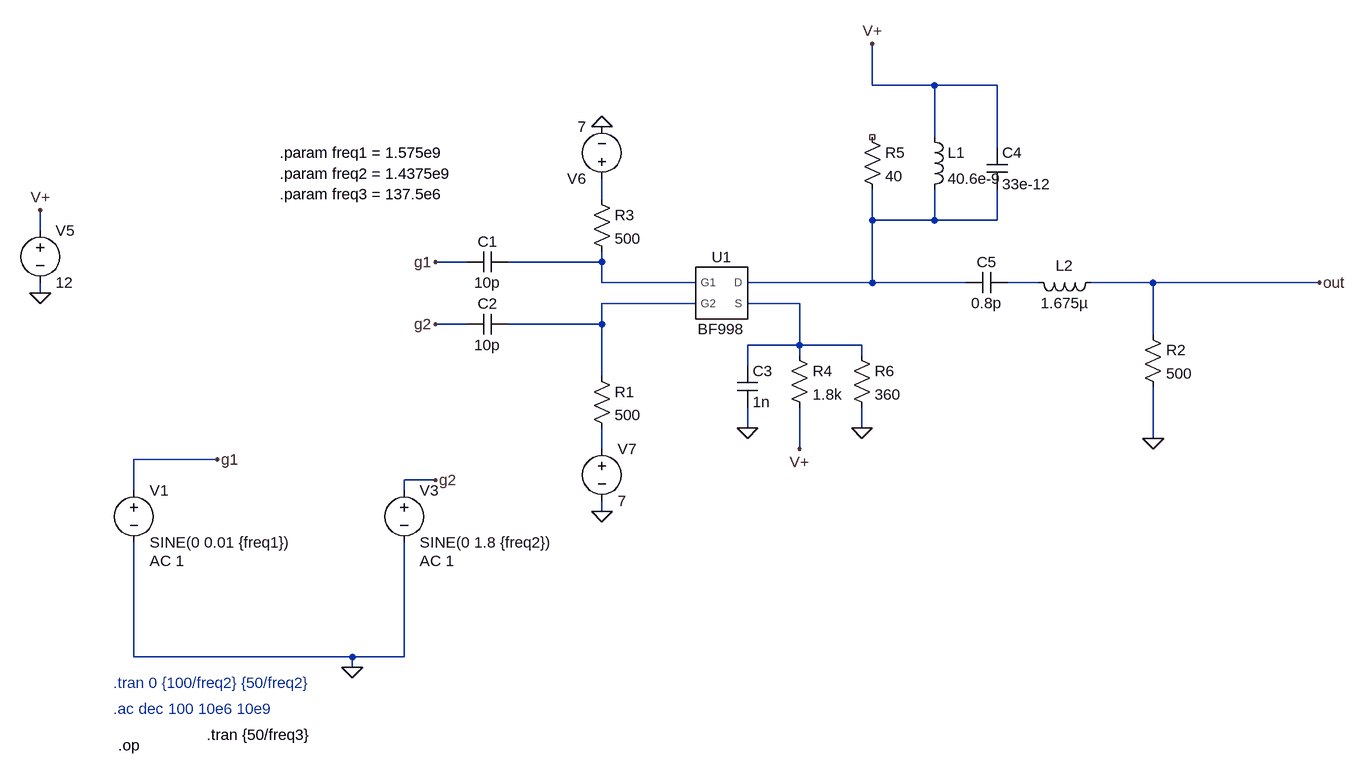
[diagram p0: schematic bf998.asc]
bf998.asc, the LTspice schematic file:
Version 4
SHEET 1 2012 1384
WIRE -64 352 -64 288
WIRE 32 352 -64 352
WIRE 128 352 32 352
WIRE 32 432 32 352
WIRE 128 448 128 352
WIRE -480 528 -480 496
WIRE -64 560 -64 512
WIRE 32 560 32 512
WIRE 32 560 -64 560
WIRE 128 560 128 512
WIRE 128 560 32 560
WIRE -1344 576 -1344 544
WIRE -688 624 -736 624
WIRE -480 624 -480 608
WIRE -480 624 -624 624
WIRE -480 656 -480 624
WIRE -336 656 -480 656
WIRE -64 656 -64 560
WIRE -64 656 -256 656
WIRE 80 656 -64 656
WIRE 192 656 144 656
WIRE 368 656 272 656
WIRE 624 656 368 656
WIRE -1344 672 -1344 656
WIRE -336 688 -480 688
WIRE -176 688 -256 688
WIRE -688 720 -736 720
WIRE -480 720 -480 688
WIRE -480 720 -624 720
WIRE 368 736 368 656
WIRE -176 752 -176 688
WIRE -176 752 -256 752
WIRE -80 752 -176 752
WIRE -176 768 -176 752
WIRE -80 768 -80 752
WIRE -256 784 -256 752
WIRE -480 800 -480 720
WIRE -256 880 -256 848
WIRE -80 880 -80 848
WIRE 368 896 368 816
WIRE -480 912 -480 880
WIRE -176 912 -176 848
WIRE -1072 928 -1200 928
WIRE -736 960 -784 960
WIRE -1200 976 -1200 928
WIRE -784 976 -784 960
WIRE -480 1008 -480 992
WIRE -1200 1232 -1200 1056
WIRE -864 1232 -1200 1232
WIRE -784 1232 -784 1056
WIRE -784 1232 -864 1232
WIRE -864 1248 -864 1232
FLAG -176 912 V+
FLAG -864 1248 0
FLAG -1344 672 0
FLAG -1072 928 g1
FLAG -736 960 g2
FLAG 624 656 out
FLAG -736 624 g1
FLAG -736 720 g2
FLAG -480 416 0
FLAG -480 1008 0
FLAG 368 896 0
FLAG -1344 544 V+
FLAG -64 288 V+
FLAG -256 880 0
FLAG -80 880 0
SYMBOL voltage -1200 960 R0
WINDOW 123 24 124 Left 2
WINDOW 39 0 0 Left 0
SYMATTR Value2 AC 1
SYMATTR InstName V1
SYMATTR Value SINE(0 0.01 {freq1})
SYMBOL voltage -784 960 R0
WINDOW 123 24 124 Left 2
WINDOW 39 0 0 Left 0
SYMATTR Value2 AC 1
SYMATTR InstName V3
SYMATTR Value SINE(0 1.8 {freq2})
SYMBOL voltage -1344 560 R0
WINDOW 123 0 0 Left 0
WINDOW 39 0 0 Left 0
SYMATTR InstName V5
SYMATTR Value 12
SYMBOL BF998 -304 672 R0
SYMATTR InstName U1
SYMBOL res 352 720 R0
SYMATTR InstName R2
SYMATTR Value 500
SYMBOL res -496 784 R0
SYMATTR InstName R1
SYMATTR Value 500
SYMBOL res -496 512 R0
SYMATTR InstName R3
SYMATTR Value 500
SYMBOL cap -624 608 R90
WINDOW 0 0 32 VBottom 2
WINDOW 3 32 32 VTop 2
SYMATTR InstName C1
SYMATTR Value 10p
SYMBOL cap -624 704 R90
WINDOW 0 0 32 VBottom 2
WINDOW 3 32 32 VTop 2
SYMATTR InstName C2
SYMATTR Value 10p
SYMBOL res -192 752 R0
SYMATTR InstName R4
SYMATTR Value 1.8k
SYMBOL cap -272 784 R0
SYMATTR InstName C3
SYMATTR Value 1n
SYMBOL cap 144 640 R90
WINDOW 0 0 32 VBottom 2
WINDOW 3 32 32 VTop 2
SYMATTR InstName C5
SYMATTR Value 0.8p
SYMBOL voltage -480 512 R180
WINDOW 123 0 0 Left 0
WINDOW 39 0 0 Left 0
SYMATTR InstName V6
SYMATTR Value 7
SYMBOL res -80 416 R0
SYMATTR InstName R5
SYMATTR Value 40
SYMBOL voltage -480 896 R0
WINDOW 123 0 0 Left 0
WINDOW 39 0 0 Left 0
SYMATTR InstName V7
SYMATTR Value 7
SYMBOL ind 16 416 R0
SYMATTR InstName L1
SYMATTR Value 40.6e-9
SYMBOL cap 112 448 R0
SYMATTR InstName C4
SYMATTR Value 33e-12
SYMBOL res -96 752 R0
SYMATTR InstName R6
SYMATTR Value 360
SYMBOL ind 288 640 R90
WINDOW 0 5 56 VBottom 2
WINDOW 3 32 56 VTop 2
SYMATTR InstName L2
SYMATTR Value 1.675µ
TEXT -976 488 Left 2 !.param freq2 = 1.4375e9
TEXT -976 456 Left 2 !.param freq1 = 1.575e9
TEXT -1232 1272 Left 2 ;.tran 0 {100/freq2} {50/freq2}
TEXT -1232 1312 Left 2 ;.ac dec 100 10e6 10e9
TEXT -1224 1368 Left 2 !.op
TEXT -976 520 Left 2 !.param freq3 = 137.5e6
TEXT -1088 1352 Left 2 !.tran {50/freq3}

The netlist it stands for:
* bf998.asc
V1 g1 0 SINE(0 0.01 {freq1}) AC 1
V3 g2 0 SINE(0 1.8 {freq2}) AC 1
V5 V+ 0 12
XU1 N006 N002 N005 N003 BF998  ; pins S D G2 G1
R2 out 0 500
R1 N005 N007 500
R3 N001 N003 500
C1 N003 g1 10p
C2 N005 g2 10p
R4 N006 V+ 1.8k
C3 N006 0 1n
C5 N004 N002 0.8p
V6 N001 0 7
R5 NC_01 N002 40
V7 N007 0 7
L1 V+ N002 40.6e-9
C4 V+ N002 33e-12
R6 N006 0 360
L2 out N004 1.675µ
.param freq2 = 1.4375e9
.param freq1 = 1.575e9
* .tran 0 {100/freq2} {50/freq2}
* .ac dec 100 10e6 10e9
.op
.param freq3 = 137.5e6
.tran {50/freq3}
.lib BF998.lib
.backanno
.end